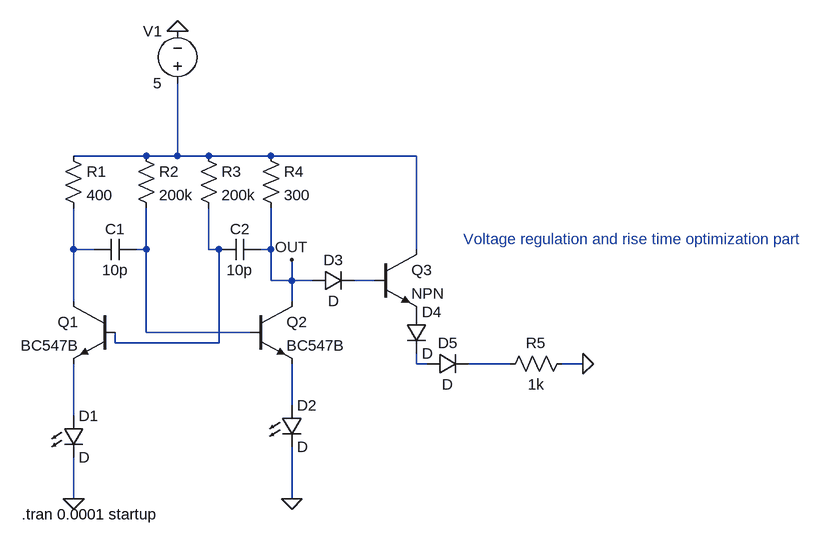
[diagram p0: schematic Astable Multivibrator.asc]
Astable Multivibrator.asc, the LTspice schematic file:
Version 4
SHEET 1 1248 680
WIRE 176 80 64 80
WIRE 224 80 224 -32
WIRE 224 80 176 80
WIRE 272 80 224 80
WIRE 368 80 272 80
WIRE 592 80 368 80
WIRE 64 224 64 160
WIRE 96 224 64 224
WIRE 176 224 176 160
WIRE 176 224 160 224
WIRE 272 224 272 160
WIRE 288 224 272 224
WIRE 368 224 368 160
WIRE 368 224 352 224
WIRE 592 224 592 80
WIRE 368 272 368 224
WIRE 400 272 400 240
WIRE 400 272 368 272
WIRE 432 272 400 272
WIRE 528 272 496 272
WIRE 64 304 64 224
WIRE 400 304 400 272
WIRE 176 352 176 224
WIRE 336 352 176 352
WIRE 128 368 128 352
WIRE 288 368 288 224
WIRE 288 368 128 368
WIRE 592 400 592 384
WIRE 608 400 592 400
WIRE 736 400 672 400
WIRE 848 400 816 400
WIRE 400 464 400 400
WIRE 64 480 64 400
WIRE 64 608 64 544
WIRE 400 608 400 528
FLAG 400 608 0
FLAG 224 -112 0
FLAG 64 608 0
FLAG 848 400 0
FLAG 400 240 OUT
SYMBOL res 48 64 R0
SYMATTR InstName R1
SYMATTR Value 400
SYMBOL res 160 64 R0
SYMATTR InstName R2
SYMATTR Value 200k
SYMBOL res 256 64 R0
SYMATTR InstName R3
SYMATTR Value 200k
SYMBOL res 352 64 R0
SYMATTR InstName R4
SYMATTR Value 300
SYMBOL cap 160 208 R90
WINDOW 0 0 32 VBottom 2
WINDOW 3 32 32 VTop 2
SYMATTR InstName C1
SYMATTR Value 10p
SYMBOL cap 352 208 R90
WINDOW 0 0 32 VBottom 2
WINDOW 3 32 32 VTop 2
SYMATTR InstName C2
SYMATTR Value 10p
SYMBOL npn 128 304 M0
SYMATTR InstName Q1
SYMATTR Value BC547B
SYMBOL npn 336 304 R0
SYMATTR InstName Q2
SYMATTR Value BC547B
SYMBOL LED 48 480 R0
SYMATTR InstName D1
SYMBOL LED 384 464 R0
SYMATTR InstName D2
SYMBOL voltage 224 -16 R180
WINDOW 0 24 96 Left 2
WINDOW 3 24 16 Left 2
WINDOW 123 0 0 Left 0
WINDOW 39 0 0 Left 0
SYMATTR InstName V1
SYMATTR Value 5
SYMBOL npn 528 224 R0
SYMATTR InstName Q3
SYMBOL diode 432 288 R270
WINDOW 0 32 32 VTop 2
WINDOW 3 0 32 VBottom 2
SYMATTR InstName D3
SYMBOL diode 576 320 R0
SYMATTR InstName D4
SYMBOL diode 608 416 R270
WINDOW 0 32 32 VTop 2
WINDOW 3 0 32 VBottom 2
SYMATTR InstName D5
SYMBOL res 832 384 R90
WINDOW 0 0 56 VBottom 2
WINDOW 3 32 56 VTop 2
SYMATTR InstName R5
SYMATTR Value 1k
TEXT -16 632 Left 2 !.tran 0.0001 startup
TEXT 664 208 Left 2 ;Voltage regulation and rise time optimization part

The netlist it stands for:
* Astable Multivibrator.asc
R1 N001 N002 400
R2 N001 N003 200k
R3 N001 N004 200k
R4 N001 OUT 300
C1 N003 N002 10p
C2 OUT N004 10p
Q1 N002 N004 N009 0 BC547B
Q2 OUT N003 N008 0 BC547B
D1 N009 0 D
D2 N008 0 D
V1 N001 0 5
Q3 N001 N005 P001 0 NPN
D3 OUT N005 D
D4 P001 N006 D
D5 N006 N007 D
R5 0 N007 1k
.model D D
.lib standard.dio
.model NPN NPN
.model PNP PNP
.lib standard.bjt
.tran 0.0001 startup
* Voltage regulation and rise time optimization part
.backanno
.end